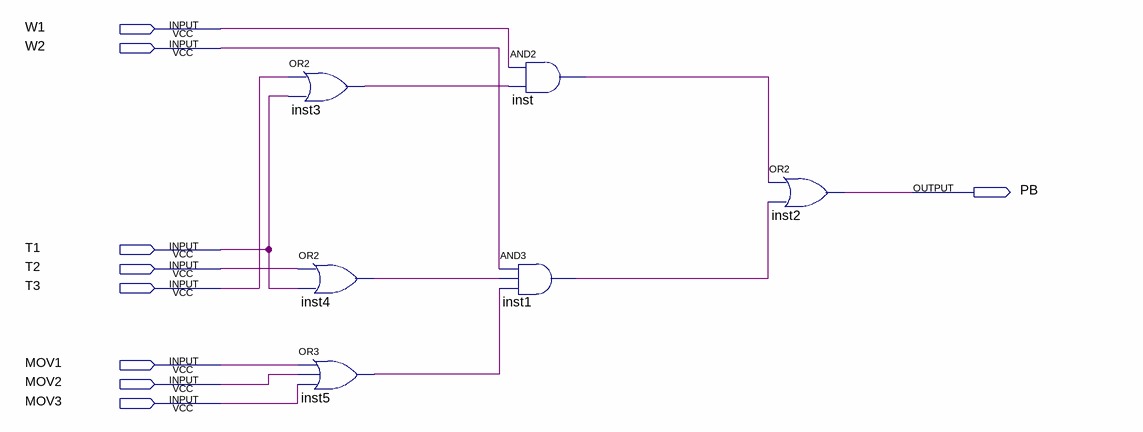
[diagram p0: schematic sheet]
// Quartus schematic PB.bdf as structural Verilog: 6 symbols, 9 pins
module PB (
  input  W1,
  input  W2,
  input  T1,
  input  T2,
  input  T3,
  input  MOV1,
  input  MOV2,
  input  MOV3,
  output PB
);

  wire inst1_out, inst3_out, inst4_out, inst5_out, inst_out;

  or inst3 (inst3_out, T3, T1);
  or inst4 (inst4_out, T2, T1);
  or inst5 (inst5_out, MOV1, MOV2, MOV3);
  and inst (inst_out, W1, inst3_out);
  and inst1 (inst1_out, W2, inst4_out, inst5_out);
  or inst2 (PB, inst_out, inst1_out);
endmodule
